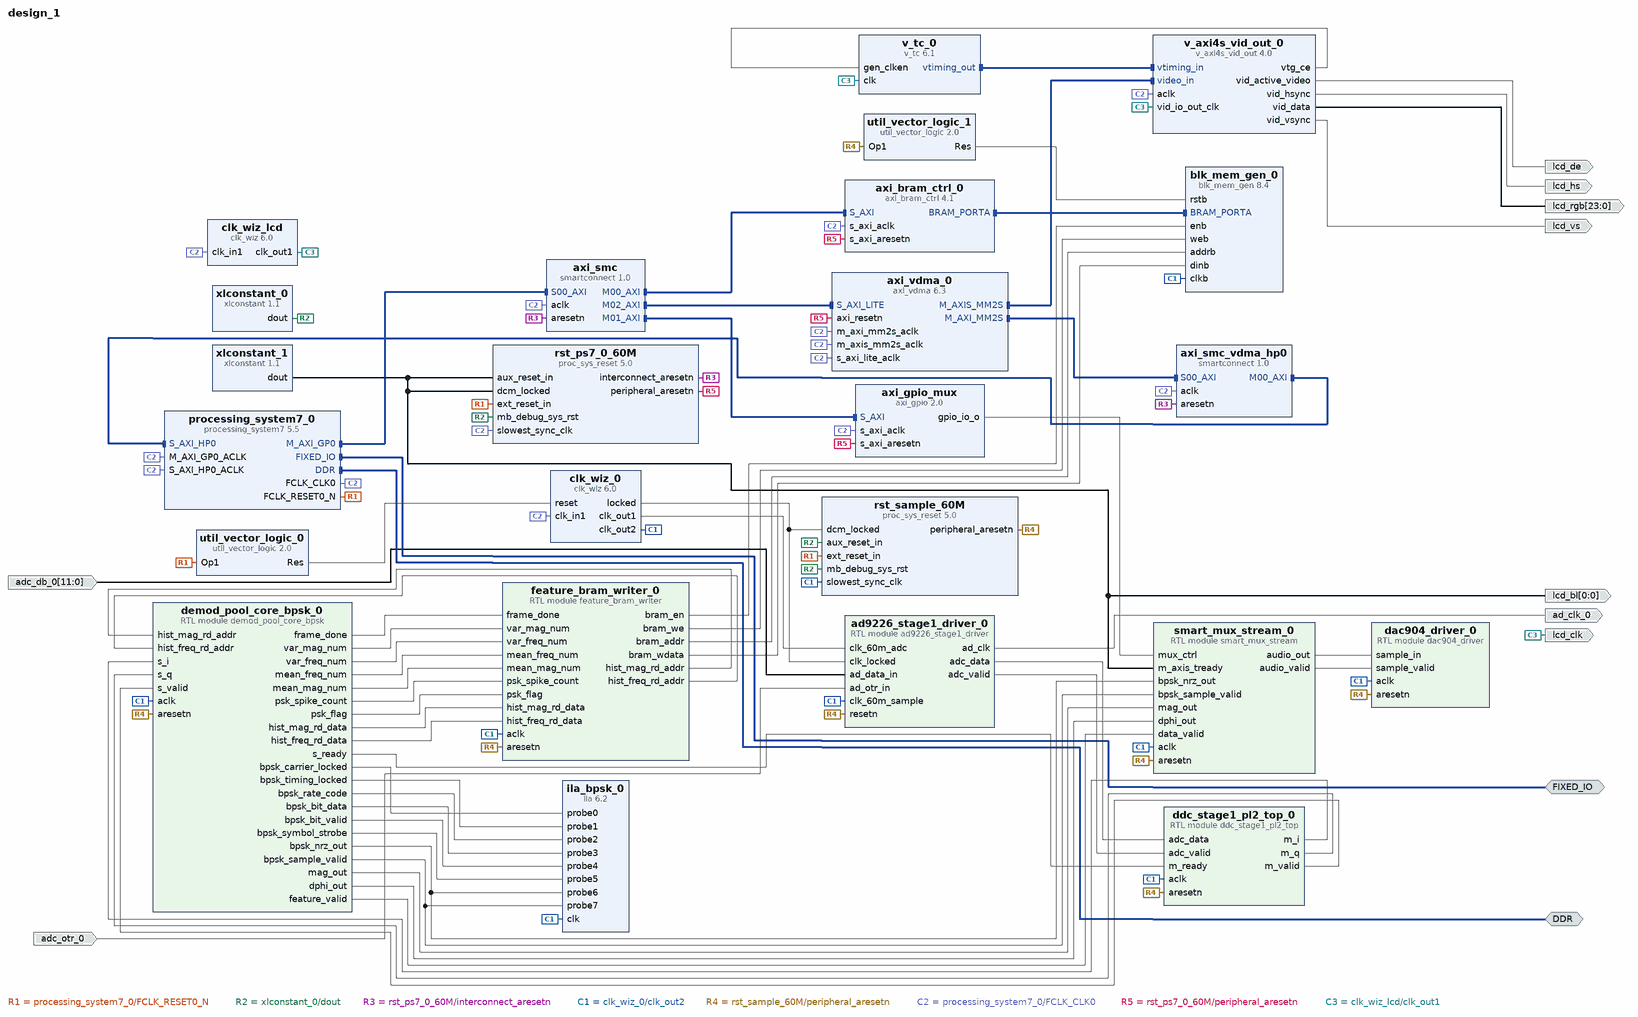
[diagram p0: block diagram of the top level]
# Vivado block design design_1, xc7z020clg400-2, Vivado 2018.3
create_bd_design design_1

create_bd_intf_port -mode Master -vlnv xilinx.com:interface:ddrx_rtl:1.0 DDR
create_bd_intf_port -mode Master -vlnv xilinx.com:display_processing_system7:fixedio_rtl:1.0 FIXED_IO
create_bd_port -dir O -type clk ad_clk_0
create_bd_port -dir I -from 11 -to 0 adc_db_0
create_bd_port -dir I adc_otr_0
create_bd_port -dir O -type clk lcd_clk
create_bd_port -dir O lcd_de
create_bd_port -dir O -from 23 -to 0 lcd_rgb
create_bd_port -dir O lcd_hs
create_bd_port -dir O lcd_vs
create_bd_port -dir O -from 0 -to 0 lcd_bl

create_bd_cell -type ip -vlnv xilinx.com:ip:processing_system7:5.5 processing_system7_0
set_property -dict [list \
  CONFIG.PCW_FPGA0_PERIPHERAL_FREQMHZ 60 \
  CONFIG.PCW_PRESET_BANK1_VOLTAGE {LVCMOS 1.8V} \
  CONFIG.PCW_UART0_PERIPHERAL_ENABLE 1 \
  CONFIG.PCW_UART0_UART0_IO {MIO 14 .. 15} \
  CONFIG.PCW_UART_PERIPHERAL_FREQMHZ 100 \
  CONFIG.PCW_UIPARAM_DDR_PARTNO {MT41J256M16 RE-125} \
  CONFIG.PCW_USE_S_AXI_HP0 1 \
] [get_bd_cells processing_system7_0]
# 42 more settings of processing_system7_0 are not shown: defaults, MIO pin electricals, DDR timing, and values the tool derives
create_bd_cell -type ip -vlnv xilinx.com:ip:axi_bram_ctrl:4.1 axi_bram_ctrl_0
set_property -dict {CONFIG.SINGLE_PORT_BRAM 1} [get_bd_cells axi_bram_ctrl_0]
create_bd_cell -type ip -vlnv xilinx.com:ip:blk_mem_gen:8.4 blk_mem_gen_0
set_property -dict [list \
  CONFIG.Assume_Synchronous_Clk true \
  CONFIG.Enable_B Use_ENB_Pin \
  CONFIG.Memory_Type True_Dual_Port_RAM \
  CONFIG.Port_A_Write_Rate 50 \
  CONFIG.Port_B_Clock 100 \
  CONFIG.Port_B_Enable_Rate 100 \
  CONFIG.Port_B_Write_Rate 50 \
  CONFIG.Use_RSTB_Pin true \
] [get_bd_cells blk_mem_gen_0]
create_bd_cell -type ip -vlnv xilinx.com:ip:proc_sys_reset:5.0 rst_ps7_0_60M
create_bd_cell -type ip -vlnv xilinx.com:ip:smartconnect:1.0 axi_smc
set_property -dict {CONFIG.NUM_MI 3 CONFIG.NUM_SI 1} [get_bd_cells axi_smc]
create_bd_cell -type ip -vlnv xilinx.com:ip:xlconstant:1.1 xlconstant_0
set_property -dict {CONFIG.CONST_VAL 0} [get_bd_cells xlconstant_0]
create_bd_cell -type ip -vlnv xilinx.com:ip:xlconstant:1.1 xlconstant_1
create_bd_cell -type ip -vlnv xilinx.com:ip:clk_wiz:6.0 clk_wiz_0
set_property -dict [list \
  CONFIG.CLKIN1_JITTER_PS 166.66 \
  CONFIG.CLKOUT1_JITTER 163.829 \
  CONFIG.CLKOUT1_PHASE_ERROR 130.371 \
  CONFIG.CLKOUT1_REQUESTED_OUT_FREQ 60 \
  CONFIG.CLKOUT2_JITTER 163.829 \
  CONFIG.CLKOUT2_PHASE_ERROR 130.371 \
  CONFIG.CLKOUT2_REQUESTED_OUT_FREQ 60 \
  CONFIG.CLKOUT2_REQUESTED_PHASE 180 \
  CONFIG.CLKOUT2_USED true \
  CONFIG.MMCM_CLKFBOUT_MULT_F 17.000 \
  CONFIG.MMCM_CLKIN1_PERIOD 16.667 \
  CONFIG.MMCM_CLKIN2_PERIOD 10.0 \
  CONFIG.MMCM_CLKOUT0_DIVIDE_F 17.000 \
  CONFIG.MMCM_CLKOUT1_DIVIDE 17 \
  CONFIG.MMCM_CLKOUT1_PHASE 180.000 \
  CONFIG.MMCM_DIVCLK_DIVIDE 1 \
  CONFIG.NUM_OUT_CLKS 2 \
  CONFIG.PRIM_IN_FREQ 60.000 \
  CONFIG.PRIM_SOURCE Global_buffer \
] [get_bd_cells clk_wiz_0]
create_bd_cell -type ip -vlnv xilinx.com:ip:util_vector_logic:2.0 util_vector_logic_0
set_property -dict {CONFIG.C_OPERATION not CONFIG.C_SIZE 1} [get_bd_cells util_vector_logic_0]
create_bd_cell -type ip -vlnv xilinx.com:ip:util_vector_logic:2.0 util_vector_logic_1
set_property -dict {CONFIG.C_OPERATION not CONFIG.C_SIZE 1} [get_bd_cells util_vector_logic_1]
create_bd_cell -type ip -vlnv xilinx.com:ip:proc_sys_reset:5.0 rst_sample_60M
create_bd_cell -type module -reference feature_bram_writer feature_bram_writer_0
create_bd_cell -type module -reference ddc_stage1_pl2_top ddc_stage1_pl2_top_0
create_bd_cell -type ip -vlnv xilinx.com:ip:ila:6.2 ila_bpsk_0
set_property -dict [list \
  CONFIG.C_ADV_TRIGGER false \
  CONFIG.C_DATA_DEPTH 8192 \
  CONFIG.C_INPUT_PIPE_STAGES 0 \
  CONFIG.C_NUM_OF_PROBES 8 \
  CONFIG.C_PROBE0_WIDTH 1 \
  CONFIG.C_PROBE1_WIDTH 1 \
  CONFIG.C_PROBE2_WIDTH 2 \
  CONFIG.C_PROBE3_WIDTH 1 \
  CONFIG.C_PROBE4_WIDTH 1 \
  CONFIG.C_PROBE5_WIDTH 1 \
  CONFIG.C_PROBE6_WIDTH 16 \
  CONFIG.C_PROBE7_WIDTH 1 \
] [get_bd_cells ila_bpsk_0]
create_bd_cell -type module -reference dac904_driver dac904_driver_0
create_bd_cell -type module -reference ad9226_stage1_driver ad9226_stage1_driver_0
create_bd_cell -type ip -vlnv xilinx.com:ip:axi_gpio:2.0 axi_gpio_mux
set_property -dict {CONFIG.C_ALL_OUTPUTS 1} [get_bd_cells axi_gpio_mux]
create_bd_cell -type module -reference smart_mux_stream smart_mux_stream_0
create_bd_cell -type ip -vlnv xilinx.com:ip:axi_vdma:6.3 axi_vdma_0
set_property -dict [list \
  CONFIG.c_include_s2mm 0 \
  CONFIG.c_m_axis_mm2s_tdata_width 24 \
  CONFIG.c_mm2s_linebuffer_depth 1024 \
  CONFIG.c_mm2s_max_burst_length 64 \
  CONFIG.c_num_fstores 1 \
] [get_bd_cells axi_vdma_0]
create_bd_cell -type ip -vlnv xilinx.com:ip:smartconnect:1.0 axi_smc_vdma_hp0
set_property -dict {CONFIG.NUM_SI 1} [get_bd_cells axi_smc_vdma_hp0]
create_bd_cell -type ip -vlnv xilinx.com:ip:clk_wiz:6.0 clk_wiz_lcd
set_property -dict [list \
  CONFIG.CLKIN1_JITTER_PS 166.66 \
  CONFIG.CLKOUT1_JITTER 214.781 \
  CONFIG.CLKOUT1_PHASE_ERROR 119.261 \
  CONFIG.CLKOUT1_REQUESTED_OUT_FREQ 33.3 \
  CONFIG.MMCM_CLKFBOUT_MULT_F 13.875 \
  CONFIG.MMCM_CLKIN1_PERIOD 16.667 \
  CONFIG.MMCM_CLKIN2_PERIOD 10.000 \
  CONFIG.MMCM_CLKOUT0_DIVIDE_F 25.000 \
  CONFIG.MMCM_DIVCLK_DIVIDE 1 \
  CONFIG.PRIM_IN_FREQ 60 \
  CONFIG.PRIM_SOURCE Global_buffer \
  CONFIG.USE_LOCKED false \
  CONFIG.USE_RESET false \
] [get_bd_cells clk_wiz_lcd]
create_bd_cell -type ip -vlnv xilinx.com:ip:v_tc:6.1 v_tc_0
set_property -dict [list \
  CONFIG.GEN_F0_VBLANK_HEND 800 \
  CONFIG.GEN_F0_VBLANK_HSTART 800 \
  CONFIG.GEN_F0_VFRAME_SIZE 525 \
  CONFIG.GEN_F0_VSYNC_HEND 800 \
  CONFIG.GEN_F0_VSYNC_HSTART 800 \
  CONFIG.GEN_F0_VSYNC_VEND 492 \
  CONFIG.GEN_F0_VSYNC_VSTART 490 \
  CONFIG.GEN_HACTIVE_SIZE 800 \
  CONFIG.GEN_HFRAME_SIZE 1056 \
  CONFIG.GEN_HSYNC_END 968 \
  CONFIG.GEN_HSYNC_START 840 \
  CONFIG.GEN_VACTIVE_SIZE 480 \
  CONFIG.HAS_AXI4_LITE false \
  CONFIG.VIDEO_MODE Custom \
  CONFIG.enable_detection false \
] [get_bd_cells v_tc_0]
create_bd_cell -type ip -vlnv xilinx.com:ip:v_axi4s_vid_out:4.0 v_axi4s_vid_out_0
set_property -dict {CONFIG.C_HAS_ASYNC_CLK 1} [get_bd_cells v_axi4s_vid_out_0]
create_bd_cell -type module -reference demod_pool_core_bpsk demod_pool_core_bpsk_0

# ---- connections ----

connect_bd_intf_net [get_bd_intf_pins axi_vdma_0/M_AXI_MM2S] [get_bd_intf_pins axi_smc_vdma_hp0/S00_AXI]
connect_bd_intf_net [get_bd_intf_pins axi_smc/M01_AXI] [get_bd_intf_pins axi_gpio_mux/S_AXI]
connect_bd_intf_net [get_bd_intf_pins axi_smc/M02_AXI] [get_bd_intf_pins axi_vdma_0/S_AXI_LITE]
connect_bd_intf_net [get_bd_intf_pins v_tc_0/vtiming_out] [get_bd_intf_pins v_axi4s_vid_out_0/vtiming_in]
connect_bd_intf_net [get_bd_intf_pins axi_vdma_0/M_AXIS_MM2S] [get_bd_intf_pins v_axi4s_vid_out_0/video_in]
connect_bd_intf_net -intf_net axi_smc_1_M00_AXI [get_bd_intf_pins axi_smc_vdma_hp0/M00_AXI] [get_bd_intf_pins processing_system7_0/S_AXI_HP0]
connect_bd_intf_net [get_bd_intf_ports FIXED_IO] [get_bd_intf_pins processing_system7_0/FIXED_IO]
connect_bd_intf_net [get_bd_intf_ports DDR] [get_bd_intf_pins processing_system7_0/DDR]
connect_bd_intf_net [get_bd_intf_pins processing_system7_0/M_AXI_GP0] [get_bd_intf_pins axi_smc/S00_AXI]
connect_bd_intf_net [get_bd_intf_pins blk_mem_gen_0/BRAM_PORTA] [get_bd_intf_pins axi_bram_ctrl_0/BRAM_PORTA]
connect_bd_intf_net [get_bd_intf_pins axi_smc/M00_AXI] [get_bd_intf_pins axi_bram_ctrl_0/S_AXI]
connect_bd_net [get_bd_pins processing_system7_0/FCLK_RESET0_N] \
  [get_bd_pins rst_ps7_0_60M/ext_reset_in] [get_bd_pins util_vector_logic_0/Op1] [get_bd_pins rst_sample_60M/ext_reset_in]
connect_bd_net [get_bd_pins feature_bram_writer_0/bram_en] [get_bd_pins blk_mem_gen_0/enb]
connect_bd_net [get_bd_pins feature_bram_writer_0/bram_we] [get_bd_pins blk_mem_gen_0/web]
connect_bd_net [get_bd_pins feature_bram_writer_0/bram_addr] [get_bd_pins blk_mem_gen_0/addrb]
connect_bd_net [get_bd_pins feature_bram_writer_0/bram_wdata] [get_bd_pins blk_mem_gen_0/dinb]
connect_bd_net [get_bd_pins xlconstant_1/dout] \
  [get_bd_pins rst_ps7_0_60M/dcm_locked] [get_bd_pins rst_ps7_0_60M/aux_reset_in] \
  [get_bd_pins smart_mux_stream_0/m_axis_tready] [get_bd_ports lcd_bl]
connect_bd_net [get_bd_pins xlconstant_0/dout] \
  [get_bd_pins rst_ps7_0_60M/mb_debug_sys_rst] [get_bd_pins rst_sample_60M/mb_debug_sys_rst] \
  [get_bd_pins rst_sample_60M/aux_reset_in]
connect_bd_net -net rst_ps7_0_100M_interconnect_aresetn [get_bd_pins rst_ps7_0_60M/interconnect_aresetn] \
  [get_bd_pins axi_smc/aresetn] [get_bd_pins axi_smc_vdma_hp0/aresetn]
connect_bd_net [get_bd_pins ad9226_stage1_driver_0/ad_clk] [get_bd_ports ad_clk_0]
connect_bd_net [get_bd_pins ad9226_stage1_driver_0/adc_data] [get_bd_pins ddc_stage1_pl2_top_0/adc_data]
connect_bd_net [get_bd_pins ad9226_stage1_driver_0/adc_valid] [get_bd_pins ddc_stage1_pl2_top_0/adc_valid]
connect_bd_net [get_bd_pins clk_wiz_0/clk_out1] [get_bd_pins ad9226_stage1_driver_0/clk_60m_adc]
connect_bd_net [get_bd_pins clk_wiz_0/locked] [get_bd_pins rst_sample_60M/dcm_locked] [get_bd_pins ad9226_stage1_driver_0/clk_locked]
connect_bd_net [get_bd_pins clk_wiz_0/clk_out2] \
  [get_bd_pins blk_mem_gen_0/clkb] [get_bd_pins rst_sample_60M/slowest_sync_clk] [get_bd_pins feature_bram_writer_0/aclk] \
  [get_bd_pins ddc_stage1_pl2_top_0/aclk] [get_bd_pins ila_bpsk_0/clk] [get_bd_pins dac904_driver_0/aclk] \
  [get_bd_pins ad9226_stage1_driver_0/clk_60m_sample] [get_bd_pins smart_mux_stream_0/aclk] \
  [get_bd_pins demod_pool_core_bpsk_0/aclk]
connect_bd_net -net ad_data_in_0_1 [get_bd_ports adc_db_0] [get_bd_pins ad9226_stage1_driver_0/ad_data_in]
connect_bd_net -net ad_otr_in_0_1 [get_bd_ports adc_otr_0] [get_bd_pins ad9226_stage1_driver_0/ad_otr_in]
connect_bd_net [get_bd_pins util_vector_logic_0/Res] [get_bd_pins clk_wiz_0/reset]
connect_bd_net [get_bd_pins util_vector_logic_1/Res] [get_bd_pins blk_mem_gen_0/rstb]
connect_bd_net [get_bd_pins rst_sample_60M/peripheral_aresetn] \
  [get_bd_pins util_vector_logic_1/Op1] [get_bd_pins feature_bram_writer_0/aresetn] \
  [get_bd_pins ddc_stage1_pl2_top_0/aresetn] [get_bd_pins dac904_driver_0/aresetn] \
  [get_bd_pins ad9226_stage1_driver_0/resetn] [get_bd_pins smart_mux_stream_0/aresetn] \
  [get_bd_pins demod_pool_core_bpsk_0/aresetn]
connect_bd_net [get_bd_pins ddc_stage1_pl2_top_0/m_i] [get_bd_pins demod_pool_core_bpsk_0/s_i]
connect_bd_net [get_bd_pins ddc_stage1_pl2_top_0/m_q] [get_bd_pins demod_pool_core_bpsk_0/s_q]
connect_bd_net [get_bd_pins ddc_stage1_pl2_top_0/m_valid] [get_bd_pins demod_pool_core_bpsk_0/s_valid]
connect_bd_net [get_bd_pins demod_pool_core_bpsk_0/s_ready] [get_bd_pins ddc_stage1_pl2_top_0/m_ready]
connect_bd_net [get_bd_pins demod_pool_core_bpsk_0/frame_done] [get_bd_pins feature_bram_writer_0/frame_done]
connect_bd_net [get_bd_pins demod_pool_core_bpsk_0/var_mag_num] [get_bd_pins feature_bram_writer_0/var_mag_num]
connect_bd_net [get_bd_pins demod_pool_core_bpsk_0/var_freq_num] [get_bd_pins feature_bram_writer_0/var_freq_num]
connect_bd_net [get_bd_pins demod_pool_core_bpsk_0/mean_freq_num] [get_bd_pins feature_bram_writer_0/mean_freq_num]
connect_bd_net [get_bd_pins demod_pool_core_bpsk_0/mean_mag_num] [get_bd_pins feature_bram_writer_0/mean_mag_num]
connect_bd_net [get_bd_pins demod_pool_core_bpsk_0/psk_spike_count] [get_bd_pins feature_bram_writer_0/psk_spike_count]
connect_bd_net [get_bd_pins demod_pool_core_bpsk_0/psk_flag] [get_bd_pins feature_bram_writer_0/psk_flag]
connect_bd_net [get_bd_pins demod_pool_core_bpsk_0/hist_mag_rd_data] [get_bd_pins feature_bram_writer_0/hist_mag_rd_data]
connect_bd_net [get_bd_pins demod_pool_core_bpsk_0/hist_freq_rd_data] [get_bd_pins feature_bram_writer_0/hist_freq_rd_data]
connect_bd_net [get_bd_pins demod_pool_core_bpsk_0/bpsk_carrier_locked] [get_bd_pins ila_bpsk_0/probe0]
connect_bd_net [get_bd_pins demod_pool_core_bpsk_0/bpsk_timing_locked] [get_bd_pins ila_bpsk_0/probe1]
connect_bd_net [get_bd_pins demod_pool_core_bpsk_0/bpsk_rate_code] [get_bd_pins ila_bpsk_0/probe2]
connect_bd_net [get_bd_pins demod_pool_core_bpsk_0/bpsk_bit_data] [get_bd_pins ila_bpsk_0/probe3]
connect_bd_net [get_bd_pins demod_pool_core_bpsk_0/bpsk_bit_valid] [get_bd_pins ila_bpsk_0/probe4]
connect_bd_net [get_bd_pins demod_pool_core_bpsk_0/bpsk_symbol_strobe] [get_bd_pins ila_bpsk_0/probe5]
connect_bd_net [get_bd_pins demod_pool_core_bpsk_0/bpsk_nrz_out] [get_bd_pins ila_bpsk_0/probe6] [get_bd_pins smart_mux_stream_0/bpsk_nrz_out]
connect_bd_net [get_bd_pins demod_pool_core_bpsk_0/bpsk_sample_valid] \
  [get_bd_pins ila_bpsk_0/probe7] [get_bd_pins smart_mux_stream_0/bpsk_sample_valid]
connect_bd_net [get_bd_pins feature_bram_writer_0/hist_mag_rd_addr] [get_bd_pins demod_pool_core_bpsk_0/hist_mag_rd_addr]
connect_bd_net [get_bd_pins feature_bram_writer_0/hist_freq_rd_addr] [get_bd_pins demod_pool_core_bpsk_0/hist_freq_rd_addr]
connect_bd_net [get_bd_pins processing_system7_0/FCLK_CLK0] \
  [get_bd_pins processing_system7_0/M_AXI_GP0_ACLK] [get_bd_pins clk_wiz_0/clk_in1] [get_bd_pins axi_smc/aclk] \
  [get_bd_pins axi_bram_ctrl_0/s_axi_aclk] [get_bd_pins rst_ps7_0_60M/slowest_sync_clk] [get_bd_pins axi_gpio_mux/s_axi_aclk] \
  [get_bd_pins processing_system7_0/S_AXI_HP0_ACLK] [get_bd_pins axi_vdma_0/s_axi_lite_aclk] \
  [get_bd_pins axi_smc_vdma_hp0/aclk] [get_bd_pins axi_vdma_0/m_axi_mm2s_aclk] [get_bd_pins clk_wiz_lcd/clk_in1] \
  [get_bd_pins axi_vdma_0/m_axis_mm2s_aclk] [get_bd_pins v_axi4s_vid_out_0/aclk]
connect_bd_net [get_bd_pins rst_ps7_0_60M/peripheral_aresetn] \
  [get_bd_pins axi_bram_ctrl_0/s_axi_aresetn] [get_bd_pins axi_gpio_mux/s_axi_aresetn] [get_bd_pins axi_vdma_0/axi_resetn]
connect_bd_net [get_bd_pins demod_pool_core_bpsk_0/mag_out] [get_bd_pins smart_mux_stream_0/mag_out]
connect_bd_net [get_bd_pins demod_pool_core_bpsk_0/dphi_out] [get_bd_pins smart_mux_stream_0/dphi_out]
connect_bd_net [get_bd_pins demod_pool_core_bpsk_0/feature_valid] [get_bd_pins smart_mux_stream_0/data_valid]
connect_bd_net [get_bd_pins smart_mux_stream_0/audio_out] [get_bd_pins dac904_driver_0/sample_in]
connect_bd_net [get_bd_pins smart_mux_stream_0/audio_valid] [get_bd_pins dac904_driver_0/sample_valid]
connect_bd_net [get_bd_pins axi_gpio_mux/gpio_io_o] [get_bd_pins smart_mux_stream_0/mux_ctrl]
connect_bd_net [get_bd_pins clk_wiz_lcd/clk_out1] [get_bd_pins v_tc_0/clk] [get_bd_pins v_axi4s_vid_out_0/vid_io_out_clk] [get_bd_ports lcd_clk]
connect_bd_net [get_bd_pins v_axi4s_vid_out_0/vtg_ce] [get_bd_pins v_tc_0/gen_clken]
connect_bd_net [get_bd_pins v_axi4s_vid_out_0/vid_active_video] [get_bd_ports lcd_de]
connect_bd_net [get_bd_pins v_axi4s_vid_out_0/vid_data] [get_bd_ports lcd_rgb]
connect_bd_net [get_bd_pins v_axi4s_vid_out_0/vid_hsync] [get_bd_ports lcd_hs]
connect_bd_net [get_bd_pins v_axi4s_vid_out_0/vid_vsync] [get_bd_ports lcd_vs]
set_property HDL_ATTRIBUTE.BMM_INFO_PROCESSOR {arm > design_1 axi_bram_ctrl_0} [get_bd_cells processing_system7_0]
set_property HDL_ATTRIBUTE.KEEP_HIERARCHY yes [get_bd_cells processing_system7_0]
set_property HDL_ATTRIBUTE.BMM_INFO_ADDRESS_SPACE {byte  0x40000000 32 > design_1 blk_mem_gen_0} [get_bd_cells axi_bram_ctrl_0]
set_property HDL_ATTRIBUTE.KEEP_HIERARCHY yes [get_bd_cells axi_bram_ctrl_0]

# ---- address map ----
assign_bd_address -offset 0x00000000 -range 1G -target_address_space [get_bd_addr_spaces axi_vdma_0/Data_MM2S] [get_bd_addr_segs processing_system7_0/S_AXI_HP0/HP0_DDR_LOWOCM]
assign_bd_address -offset 0x40000000 -range 8K -target_address_space [get_bd_addr_spaces processing_system7_0/Data] [get_bd_addr_segs axi_bram_ctrl_0/S_AXI/Mem0]
assign_bd_address -offset 0x41200000 -range 64K -target_address_space [get_bd_addr_spaces processing_system7_0/Data] [get_bd_addr_segs axi_gpio_mux/S_AXI/Reg]
assign_bd_address -offset 0x43000000 -range 64K -target_address_space [get_bd_addr_spaces processing_system7_0/Data] [get_bd_addr_segs axi_vdma_0/S_AXI_LITE/Reg]

validate_bd_design
save_bd_design
